# Altium schematic sheet dac-layout.SchDoc: DAC
size A4; DrawnBy: Dylan Vogel; Organization: UTAT SS; DocumentNumber: 10; Revision: 1; SheetNumber: 10; SheetTotal: 11
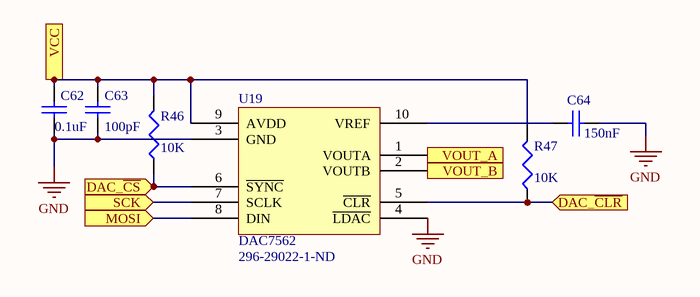
[diagram p0: dac-layout.SchDoc]

## Parts
C62  0.1uF  [0402]
C63  100pF  [0402]
C64  150nF  [0402]
R46  10K  [0402]
R47  10K  [0402]
U19  DAC7562  Supplier Part Number 1: 296-29022-1-ND  [SOP10-50P300X300-10N]

## Ports
DAC_~{CLR} (in), DAC_~{CS} (in), MOSI (in), SCK (in), VCC (in), VOUT_A (out), VOUT_B (out)

## Nets
GND: C62.1 C63.1 C64.2 U19.3(GND) U19.4(~{LDAC})
DAC_~{CLR}: R47.1 U19.5(~{CLR}) ; port DAC_~{CLR}
DAC_~{CS}: R46.1 U19.6(~{SYNC}) ; port DAC_~{CS}
MOSI: U19.8(DIN) ; port MOSI
SCK: U19.7(SCLK) ; port SCK
VCC: C62.2 C63.2 R46.2 R47.2 U19.9(AVDD) ; port VCC
VOUT_A: U19.1(VOUTA) ; port VOUT_A
VOUT_B: U19.2(VOUTB) ; port VOUT_B
NetC64_1: C64.1 U19.10(VREF)

## Library data of the parts
C62-C64 = Cap Semi: Capacitor (Semiconductor SIM Model); Published: 8-Jun-2000; LatestRevisionDate: 29-May-2009; LatestRevisionNote: IPC-7351 Footprint Added.; PackageReference: C1206; Publisher: Altium Limited; PackageDescription: Chip Capacitor; Supplier: Digi-Key
  C62: Value: 0.1uF; Supplier Part Number: 587-3807-1-ND
  C63: Value: 100pF; Supplier Part Number: 1276-1632-1-ND
  C64: Value: 150nF; Supplier Part Number: 1276-1972-1-ND
R46 R47 = Res3: Resistor; Published: 8-Jun-2000; LatestRevisionDate: 29-May-2009; LatestRevisionNote: IPC-7351 Footprint Added.; PackageReference: J1-0603; Publisher: Altium Limited; PackageDescription: Chip Resistor; Value: 10K; Supplier: Digi-Key
U19 = DAC7562: 12-bit, low-power, voltage-output DAC with internal reference.; Supplier 1: Digi-Key; Supplier: Digi-Key